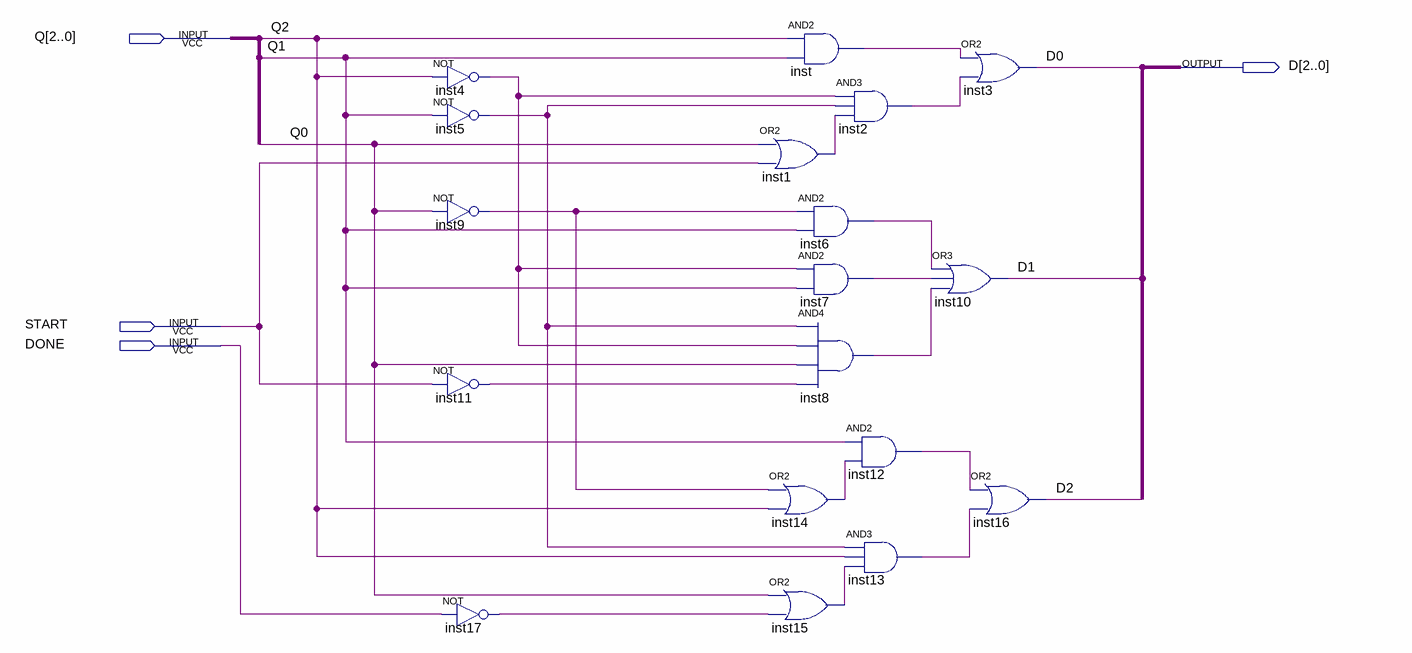
[diagram p0: schematic sheet]
// Quartus schematic NextStateLogic.bdf as structural Verilog: 18 symbols, 4 pins
module NextStateLogic (
  input  [2:0] Q,
  input  START,
  input  DONE,
  output [2:0] D
);

  wire inst1_out, inst2_out, inst4_out, inst5_out, inst6_out, inst7_out, inst8_out, inst9_out, inst11_out,
       inst12_out, inst13_out, inst14_out, inst15_out, inst17_out, inst_out;

  not inst4 (inst4_out, Q[2]);
  not inst5 (inst5_out, Q[1]);
  not inst9 (inst9_out, Q[0]);
  not inst11 (inst11_out, START);
  not inst17 (inst17_out, DONE);
  and inst (inst_out, Q[2], Q[1]);
  or inst1 (inst1_out, Q[0], START);
  and inst6 (inst6_out, inst9_out, Q[1]);
  and inst7 (inst7_out, inst4_out, Q[1]);
  and inst8 (inst8_out, inst5_out, inst4_out, Q[0], inst11_out);
  or inst14 (inst14_out, inst9_out, Q[2]);
  or inst15 (inst15_out, Q[0], inst17_out);
  and inst2 (inst2_out, inst4_out, inst5_out, inst1_out);
  and inst12 (inst12_out, Q[1], inst14_out);
  and inst13 (inst13_out, inst5_out, Q[2], inst15_out);
  or inst3 (D[0], inst_out, inst2_out);
  or inst10 (D[1], inst6_out, inst7_out, inst8_out);
  or inst16 (D[2], inst12_out, inst13_out);
endmodule
